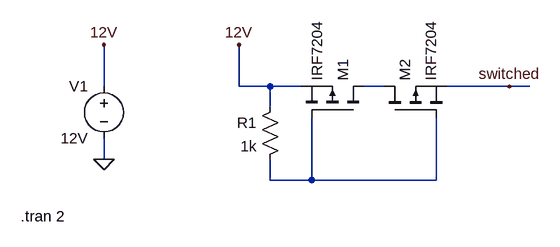
[diagram p0: schematic Draft2.asc]
Draft2.asc, the LTspice schematic file:
Version 4
SHEET 1 916 680
WIRE 224 176 224 112
WIRE 432 176 432 112
WIRE 480 176 432 176
WIRE 528 176 480 176
WIRE 656 176 624 176
WIRE 848 176 752 176
WIRE 880 176 848 176
WIRE 480 208 480 176
WIRE 224 288 224 256
WIRE 480 320 480 288
WIRE 544 320 544 224
WIRE 544 320 480 320
WIRE 736 320 736 224
WIRE 736 320 544 320
FLAG 432 112 12V
FLAG 848 176 switched
FLAG 224 288 0
FLAG 224 112 12V
SYMBOL pmos 624 224 M270
SYMATTR InstName M1
SYMATTR Value IRF7204
SYMBOL res 496 192 M0
SYMATTR InstName R1
SYMATTR Value 1k
SYMBOL pmos 656 224 R270
SYMATTR InstName M2
SYMATTR Value IRF7204
SYMBOL voltage 224 160 M0
SYMATTR InstName V1
SYMATTR Value 12V
TEXT 96 376 Left 2 !.tran 2

The netlist it stands for:
* Draft2.asc
M1 N001 N002 12V 12V IRF7204
R1 12V N002 1k
M2 N001 N002 switched switched IRF7204
V1 12V 0 12V
.model NMOS NMOS
.model PMOS PMOS
.lib standard.mos
.tran 2
.backanno
.end